# Altium schematic sheet SAMW25_Xplained_Pro_TopLevel.SchDoc: Top Level Schematics
size A3; Organization: ATMEL Norway; Address1: Vestre Rosten 79; Address2: N-7075 TILLER; Address3: NORWAY; DocumentNumber: A09-2449; Revision: 1; SheetNumber: 1; SheetTotal: 5; PageSetup: Record=PageOptions|CenterHorizontal=True|CenterVertical=True|PrintScale=1.01|XCorrection=1.00|YCorrection=1.00|PrintKind=1|BorderSize=5000000|LeftOffset=0|BottomOffset=0|Orientation=2|PaperLength=1000|PaperWidth=1000|Scale=100|PaperSource=7|PrintQuality=-4|MediaType=1|DitherType=10|PaperKind=Letter|PrintScaleMode=1
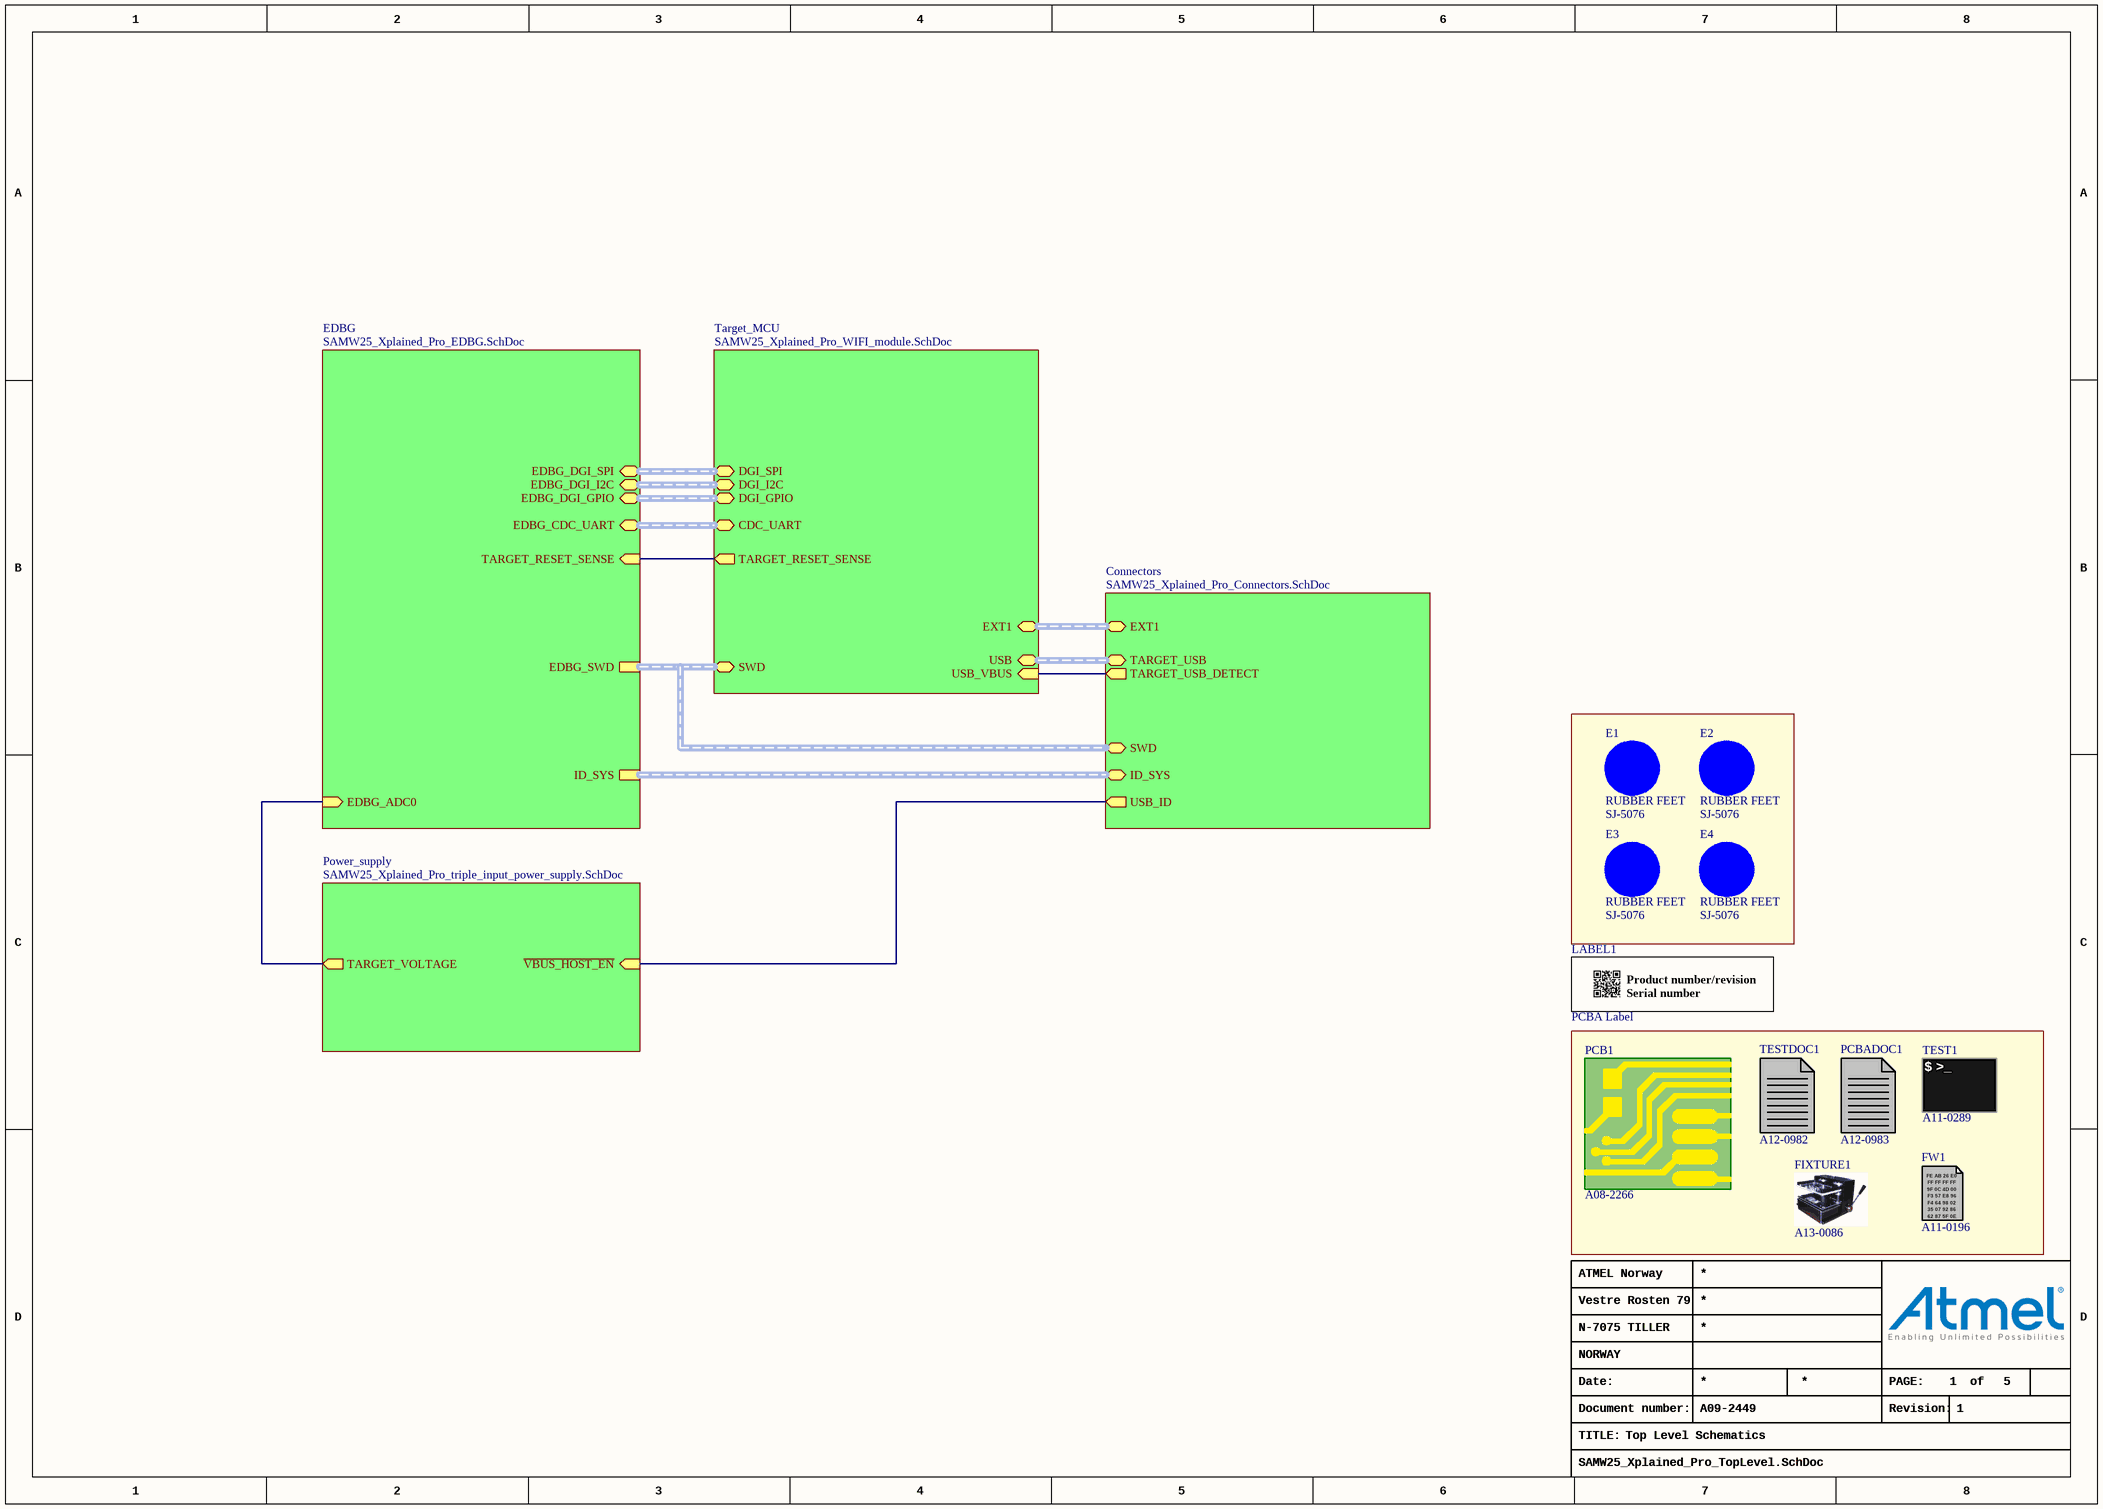
[diagram p0: SAMW25_Xplained_Pro_TopLevel.SchDoc]

## Parts
E1  RUBBER FEET  value SJ-5076  [AP8-00192]
E2  RUBBER FEET  value SJ-5076  [AP8-00192]
E3  RUBBER FEET  value SJ-5076  [AP8-00192]
E4  RUBBER FEET  value SJ-5076  [AP8-00192]
FIXTURE1  AN: A13-0086  (hidden comment: JIG)  (mechanical)
FW1  AN: A11-0196  (hidden comment: FW)  (mechanical)
LABEL1  value PCBA Label  [AP8-00317]  (hidden comment: PCBA_LABEL)
PCB1  AN: A08-2266  (hidden comment: PCB)  (mechanical)
PCBADOC1  AN: A12-0983  (hidden comment: PCBADOC)  (mechanical)
TEST1  AN: A11-0289  (hidden comment: TEST)  (mechanical)
TESTDOC1  AN: A12-0982  (hidden comment: TESTDOC)  (mechanical)

## Sub-sheets
Connectors = SAMW25_Xplained_Pro_Connectors.SchDoc: ID_SYS (harness ID_SYS), EXT1 (harness EXT), TARGET_USB (harness USB), TARGET_USB_DETECT (out), USB_ID (out), SWD (harness SWD)
EDBG = SAMW25_Xplained_Pro_EDBG.SchDoc: ID_SYS (harness ID_SYS), EDBG_SWD (harness SWD), EDBG_CDC_UART (harness CDC_UART), EDBG_DGI_I2C (harness DGI_I2C), EDBG_DGI_SPI (harness DGI_SPI), EDBG_DGI_GPIO (harness DGI_GPIO), TARGET_RESET_SENSE (in), EDBG_ADC0 (in)
Power_supply = SAMW25_Xplained_Pro_triple_input_power_supply.SchDoc: TARGET_VOLTAGE (out), ~{VBUS_HOST_EN} (in)
Target_MCU = SAMW25_Xplained_Pro_WIFI_module.SchDoc: SWD (harness SWD), DGI_SPI (harness DGI_SPI), DGI_I2C (harness DGI_I2C), DGI_GPIO (harness DGI_GPIO), CDC_UART (harness CDC_UART), TARGET_RESET_SENSE (out), EXT1 (harness EXT), USB (harness USB), USB_VBUS (in)

## Nets
(unnamed): sheet Target_MCU/TARGET_RESET_SENSE, sheet EDBG/TARGET_RESET_SENSE
(unnamed): sheet Target_MCU/USB_VBUS, sheet Connectors/TARGET_USB_DETECT
(unnamed): sheet EDBG/EDBG_ADC0, sheet Power_supply/TARGET_VOLTAGE
(unnamed): sheet Connectors/USB_ID, sheet Power_supply/~{VBUS_HOST_EN}

Not connected (* = marked no-connect by the designer): E1 1(FIDUCIAL); E2 1(FIDUCIAL); E3 1(FIDUCIAL); E4 1(FIDUCIAL)

## Buses and harness runs
harness sheet Connectors/EXT1 = sheet Target_MCU/EXT1
harness sheet Connectors/ID_SYS = sheet EDBG/ID_SYS
harness sheet Connectors/SWD = sheet EDBG/EDBG_SWD = sheet Target_MCU/SWD
harness sheet Connectors/TARGET_USB = sheet Target_MCU/USB
harness sheet EDBG/EDBG_CDC_UART = sheet Target_MCU/CDC_UART
harness sheet EDBG/EDBG_DGI_GPIO = sheet Target_MCU/DGI_GPIO
harness sheet EDBG/EDBG_DGI_I2C = sheet Target_MCU/DGI_I2C
harness sheet EDBG/EDBG_DGI_SPI = sheet Target_MCU/DGI_SPI

## Notes on the sheet
- Date:
- PAGE:
- of
- TITLE:
- Document number:
- Revision:
- (in symbol A09-0611) / Product number/revision / Serial number
- (in symbol A11-0196) FE AB 26 E0; FF FF FF FF; 9F 0C 4D 00; F3 57 E8 96; F4 64 98 02; 35 07 92 86; 62 87 5F 0E
- (in symbol A11-0289) $ >_

## Library data of the parts
E1-E4 = A08-0053: 2.8mm adhesive feet,diam 8.0mm; PartGroup: Mechanical devices,Mounting accessories; Manufacturer: 3M; ComponentStatus: 'Active (verified)'; Verified date: 2006-05-05; Verified by: Ketil Skjerve; Status: Active; AN: A08-0053; Height: 2,79999995231628; MPN: SJ-5076; FootprintStatus: 'Active (Verified)'
FIXTURE1 = A13-0086: Xplained PRO MCU board Jupiter Test Fixture; PartGroup: Test Equipment,Test Fixtures; Manufacturer: ESCATEC; ComponentStatus: 'Active (verified)'; Value: Xplained PRO MCU board Jupiter Test Fixture; MPN: Xplained PRO MCU board Jupiter Test Fixture
FW1 = A11-0196: EDBG secured firmware; PartGroup: Software,Firmware,Tools; Manufacturer: ATMEL; ComponentStatus: 'Active (verified)'; Value: EDBG secured firmware
LABEL1 = A09-0611: PCBA identification label PP Top White Gloss; PartGroup: Mechanical devices,Packaging materials,Printed Labels; Manufacturer: ACT Logimark AS; MPN: 505462; ComponentStatus: 'Active (verified)'; AN: A09-0611; Status: New; FootprintStatus: 'Active (Verified)'
PCB1 = A08-2266: SAM W25 Xplained Pro PCB documentation; PartGroup: Mechanical devices,Printed circuit boards; ComponentStatus: 'New (not verified)'; Value: SAM W25 Xplained Pro PCB documentation
PCBADOC1 = A12-0983: SAM W25 Xplained Pro PCBA documentation; PartGroup: Documentation,PCBA Documents,Atmel; Value: A09-2449 PCBA Files; ComponentStatus: 'New (not verified)'
TEST1 = A11-0289: Fixture test for SAM W25 Xplained Pro; PartGroup: Software,Test software,Starter Kit; Value: SAM W25 Xplained Pro test; ComponentStatus: 'New (not verified)'
TESTDOC1 = A12-0982: SAM W25 Xplained Pro test Instructions; PartGroup: Documentation,Procedures,Test Instructions; ComponentStatus: 'New (not verified)'; Value: SAM W25 Xplained Pro test Instructions